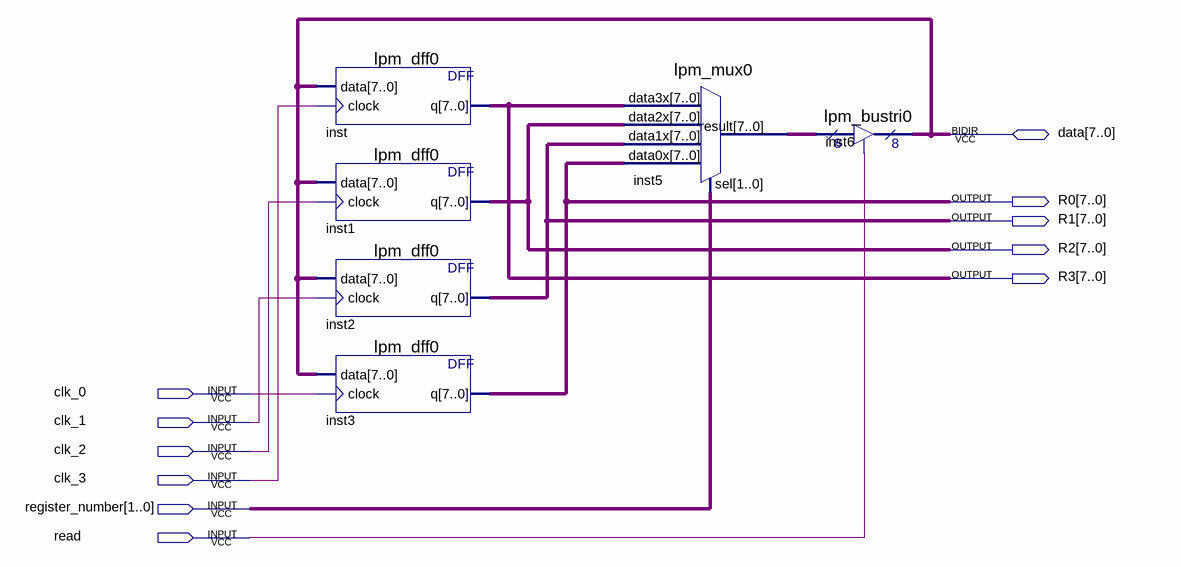
[diagram p0: schematic sheet]
// Quartus schematic registers.bdf as structural Verilog: 6 symbols, 11 pins
module registers (
  input  clk_0,
  input  clk_1,
  input  clk_2,
  input  clk_3,
  input  [1:0] register_number,
  input  read,
  inout  [7:0] data,
  output [7:0] R0,
  output [7:0] R1,
  output [7:0] R2,
  output [7:0] R3
);

  wire [7:0] inst5_result;

  lpm_dff0 inst (.data(data), .clock(clk_3), .q(R3));
  lpm_dff0 inst1 (.data(data), .clock(clk_2), .q(R2));
  lpm_dff0 inst2 (.data(data), .clock(clk_1), .q(R1));
  lpm_dff0 inst3 (.data(data), .clock(clk_0), .q(R0));
  lpm_mux0 inst5 (.data3x(R3), .data2x(R2), .data1x(R1), .data0x(R0), .sel(register_number), .result(inst5_result));
  lpm_bustri0 inst6 (.enabledt(read), .data(inst5_result), .tridata(data));
endmodule
